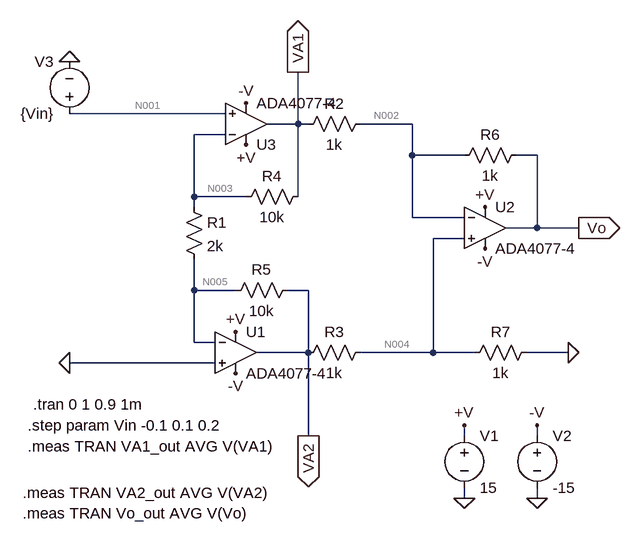
[diagram p0: schematic InstrumentationAmplifierCircuit_single_input.asc]
InstrumentationAmplifierCircuit_single_input.asc, the LTspice schematic file:
Version 4.1
SHEET 1 880 680
WIRE 0 -144 -240 -144
WIRE 112 -128 112 -208
WIRE 112 -128 64 -128
WIRE 128 -128 112 -128
WIRE 288 -128 208 -128
WIRE 0 -112 -48 -112
WIRE 288 -80 288 -128
WIRE 368 -80 288 -80
WIRE 480 -80 448 -80
WIRE -48 -16 -48 -112
WIRE 32 -16 -48 -16
WIRE 112 -16 112 -128
WIRE -48 0 -48 -16
WIRE 288 16 288 -80
WIRE 368 16 288 16
WIRE 480 32 480 -80
WIRE 480 32 432 32
WIRE 544 32 480 32
WIRE 368 48 320 48
WIRE -48 128 -48 80
WIRE 16 128 -48 128
WIRE 128 128 96 128
WIRE -48 208 -48 128
WIRE -16 208 -48 208
WIRE 128 224 128 128
WIRE 128 224 48 224
WIRE 320 224 320 48
WIRE 320 224 208 224
WIRE 384 224 320 224
WIRE 528 224 464 224
WIRE -16 240 -240 240
WIRE 128 352 128 224
WIRE 368 352 368 336
WIRE 480 352 480 336
WIRE 368 448 368 432
WIRE 480 448 480 432
FLAG 32 -96 +V
FLAG 32 -160 -V
FLAG 16 192 +V
FLAG 16 256 -V
FLAG 400 0 +V
FLAG 400 64 -V
FLAG 544 32 Vo
IOPIN 544 32 Out
FLAG 528 224 0
FLAG 112 -208 VA1
IOPIN 112 -208 Out
FLAG 128 352 VA2
IOPIN 128 352 Out
FLAG -240 240 0
FLAG 368 336 +V
FLAG 368 448 0
FLAG 480 336 -V
FLAG 480 448 0
FLAG -240 -224 0
SYMBOL res -64 -16 R0
SYMATTR InstName R1
SYMATTR Value 2k
SYMBOL res 224 -144 R90
WINDOW 0 0 56 VBottom 2
WINDOW 3 32 56 VTop 2
SYMATTR InstName R2
SYMATTR Value 1k
SYMBOL res 224 208 R90
WINDOW 0 0 56 VBottom 2
WINDOW 3 32 56 VTop 2
SYMATTR InstName R3
SYMATTR Value 1k
SYMBOL res 128 -32 R90
WINDOW 0 0 56 VBottom 2
WINDOW 3 32 56 VTop 2
SYMATTR InstName R4
SYMATTR Value 10k
SYMBOL res 112 112 R90
WINDOW 0 0 56 VBottom 2
WINDOW 3 32 56 VTop 2
SYMATTR InstName R5
SYMATTR Value 10k
SYMBOL res 464 -96 R90
WINDOW 0 0 56 VBottom 2
WINDOW 3 32 56 VTop 2
SYMATTR InstName R6
SYMATTR Value 1k
SYMBOL res 480 208 R90
WINDOW 0 0 56 VBottom 2
WINDOW 3 32 56 VTop 2
SYMATTR InstName R7
SYMATTR Value 1k
SYMBOL OpAmps\\ADA4077-4 16 160 R0
SYMATTR InstName U1
SYMBOL OpAmps\\ADA4077-4 400 -32 R0
SYMATTR InstName U2
SYMBOL OpAmps\\ADA4077-4 32 -64 M180
SYMATTR InstName U3
SYMBOL voltage 368 336 R0
WINDOW 123 0 0 Left 2
WINDOW 39 0 0 Left 2
SYMATTR InstName V1
SYMATTR Value 15
SYMBOL voltage 480 336 R0
WINDOW 123 24 146 Left 2
WINDOW 39 24 125 Left 2
SYMATTR InstName V2
SYMATTR Value -15
SYMBOL voltage -240 -128 R180
WINDOW 0 24 96 Left 2
WINDOW 3 24 16 Left 2
WINDOW 123 0 0 Left 0
WINDOW 39 0 0 Left 0
SYMATTR InstName V3
SYMATTR Value {Vin}
TEXT -296 304 Left 2 !.tran 0 1 0.9 1m
TEXT -304 368 Left 2 !.meas TRAN VA1_out AVG V(VA1)
TEXT -312 440 Left 2 !.meas TRAN VA2_out AVG V(VA2)\n.meas TRAN Vo_out AVG V(Vo)
TEXT -304 336 Left 2 !.step param Vin -0.1 0.1 0.2

The netlist it stands for:
* InstrumentationAmplifierCircuit_single_input.asc
R1 N003 N005 2k
R2 N002 VA1 1k
R3 N004 VA2 1k
R4 VA1 N003 10k
R5 VA2 N005 10k
R6 Vo N002 1k
R7 0 N004 1k
X§U1 0 N005 +V -V VA2 ADA4077-4  ; pins In+ In- V+ V- OUT
X§U2 N004 N002 +V -V Vo ADA4077-4  ; pins In+ In- V+ V- OUT
X§U3 N001 N003 +V -V VA1 ADA4077-4  ; pins In+ In- V+ V- OUT
V1 +V 0 15
V2 -V 0 -15
V3 N001 0 {Vin}
.tran 0 1 0.9 1m
.meas TRAN VA1_out AVG V(VA1)
.meas TRAN VA2_out AVG V(VA2)
.meas TRAN Vo_out AVG V(Vo)
.step param Vin -0.1 0.1 0.2
.backanno
.end

* Results of the author's LTspice run, read from the files saved beside the schematic
* Operating Point (first step), zero values left out:
*   V(n005) = 9.98 µV
*   V(va1) = -600 mV
*   V(n004) = 250 mV
*   V(vo) = 1.1 V
*   V(n001) = -100 mV
*   V(n003) = -99.99 mV
*   V(n002) = 250 mV
*   V(va2) = 500 mV
*   V(+v) = 15 V
*   V(-v) = -15 V
*   I(R3) = -250 µA
*   I(R5) = 50 µA
*   I(R6) = 850 µA
*   I(V1) = -1.45 mA
*   I(R1) = -50 µA
*   I(R2) = 850 µA
*   I(R4) = -50 µA
*   I(R7) = -250 µA
*   I(V2) = 1.45 mA
*   I(V3) = 402.6 pA
*   Ix(u2:1) = -397.5 pA
*   Ix(u2:2) = -495.3 pA
*   Ix(u2:3) = 1.25 mA
*   Ix(u2:4) = -1.25 mA
*   Ix(u2:5) = -850 µA
*   Ix(u1:1) = -401.1 pA
*   Ix(u1:2) = -498.9 pA
*   Ix(u1:3) = 700 µA
*   Ix(u1:4) = -700 µA
*   Ix(u1:5) = -300 µA
*   Ix(u3:1) = -402.6 pA
*   Ix(u3:2) = -500.3 pA
*   Ix(u3:3) = -500 µA
*   Ix(u3:4) = 500 µA
*   Ix(u3:5) = 900 µA
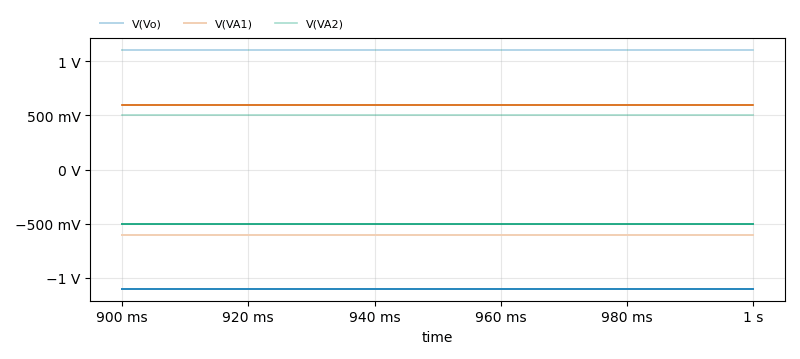
[diagram p1: Transient Analysis of InstrumentationAmplifierCircuit_single_input.asc, plotted from the saved traces]
* Transient Analysis, 2 runs:
*   V(Vo) [vin=-0.1]: min 1.1 V, max 1.1 V, average 1.1 V, rms 1.1 V, last 1.1 V
*   V(Vo) [vin=0.1]: min -1.1 V, max -1.1 V, average -1.1 V, rms 1.1 V, last -1.1 V
*   V(VA1) [vin=-0.1]: min -600 mV, max -600 mV, average -600 mV, rms 600 mV, last -600 mV
*   V(VA1) [vin=0.1]: min 600 mV, max 600 mV, average 600 mV, rms 600 mV, last 600 mV
*   V(VA2) [vin=-0.1]: min 500 mV, max 500 mV, average 500 mV, rms 500 mV, last 500 mV
*   V(VA2) [vin=0.1]: min -500 mV, max -500 mV, average -500 mV, rms 500 mV, last -500 mV
* From the log:
*   Measurement: va1_out
*     step  AVG(V(VA1))  FROM  TO
*        1  -0.599991858006  0  0.1
*        2  0.600002169609  0  0.1
*   Measurement: va2_out
*     step  AVG(V(VA2))  FROM  TO
*        1  0.500002324581  0  0.1
*        2  -0.499992012978  0  0.1
*   Measurement: vo_out
*     step  AVG(V(Vo))  FROM  TO
*        1  1.10001349449  0  0.1
*        2  -1.09997308254  0  0.1